# Altium project LP_LED_CUBE_8x8x8.PrjPcb
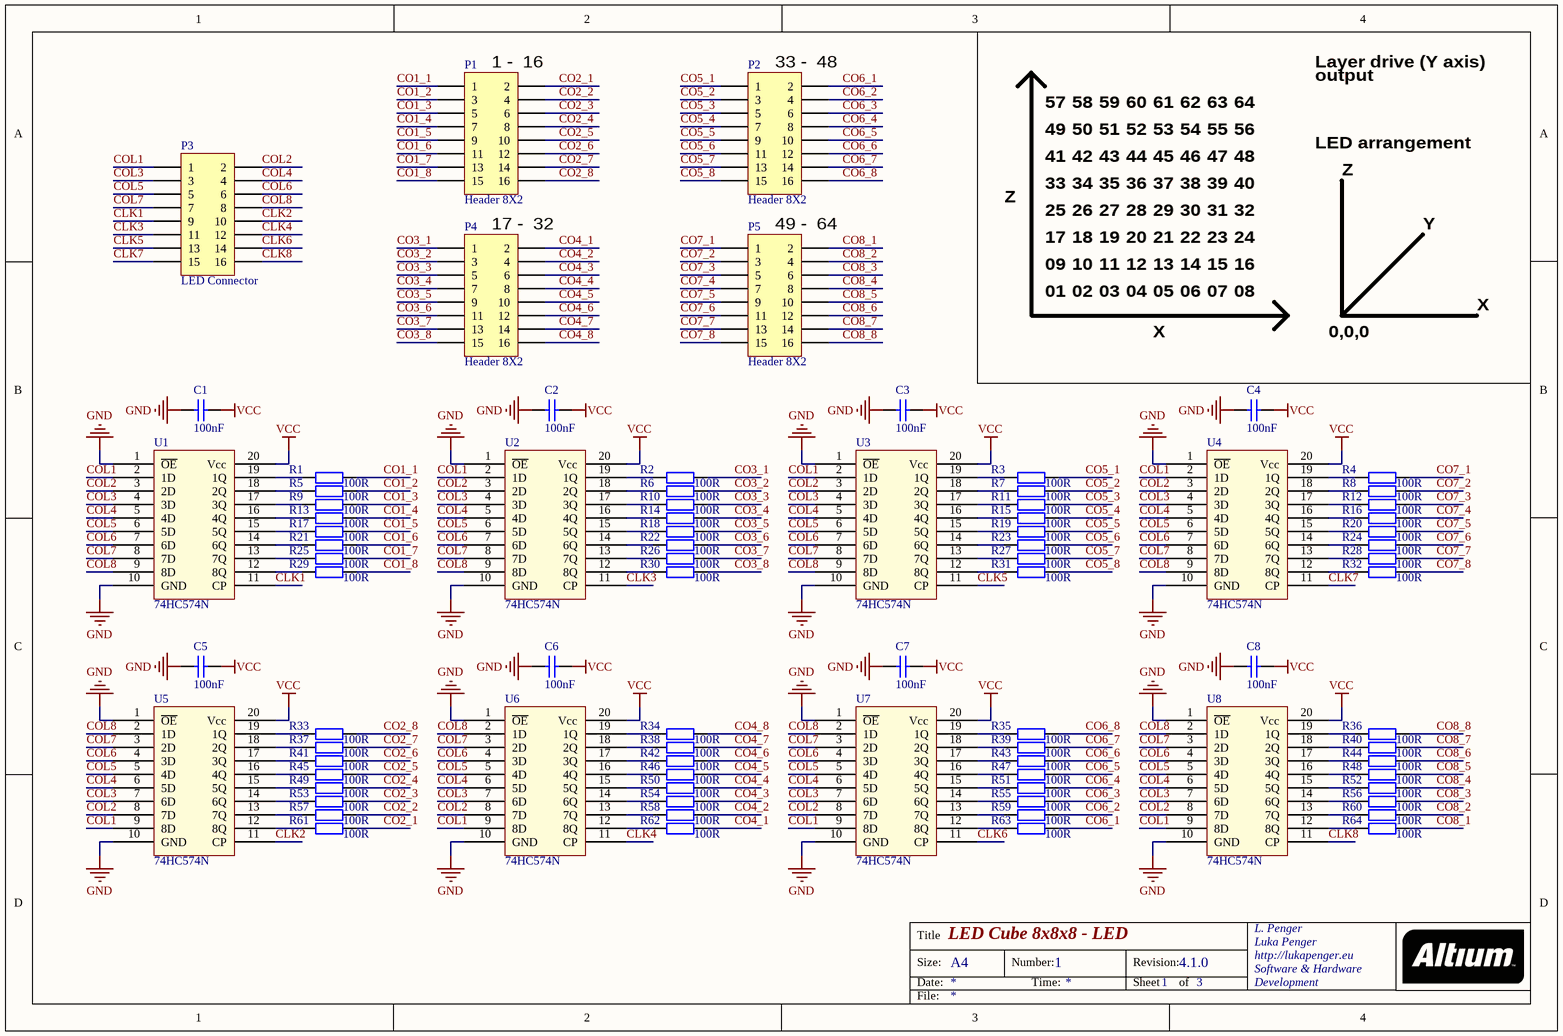
[diagram p0: LED.SchDoc]
Title: LED Cube 8x8x8
3 sheets, 153 parts. Net scope: global (net labels, ports and power ports of the same name join across sheets).
Board file: LP_LED_CUBE_8x8x8.PcbDoc
Sheets:
  LED.SchDoc
  LED_ROWS.SchDoc
  POWER.SchDoc

## Sheet LED.SchDoc: LED Cube 8x8x8 - LED
size A4; Author: Luka Penger; CompanyName: L. Penger; DrawnBy: Luka Penger; Organization: L. Penger; Address1: Luka Penger; Address2: http://lukapenger.eu; Address3: Software & Hardware; Address4: Development; DocumentNumber: 1; Revision: 4.1.0; SheetNumber: 1; SheetTotal: 3; DocumentName: LED; ProjectName: LED Cube 8x8x8

### Parts
C1  100nF  [1608[0603]]
C2  100nF  [1608[0603]]
C3  100nF  [1608[0603]]
C4  100nF  [1608[0603]]
C5  100nF  [1608[0603]]
C6  100nF  [1608[0603]]
C7  100nF  [1608[0603]]
C8  100nF  [1608[0603]]
P1  Header 8X2  [IDC-2x8]
P2  Header 8X2  [IDC-2x8]
P3  LED Connector  [IDC-2x8]
P4  Header 8X2  [IDC-2x8]
P5  Header 8X2  [IDC-2x8]
R1  100R  [C1206]
R2  100R  [C1206]
R3  100R  [C1206]
R4  100R  [C1206]
R5  100R  [C1206]
R6  100R  [C1206]
R7  100R  [C1206]
R8  100R  [C1206]
R9  100R  [C1206]
R10  100R  [C1206]
R11  100R  [C1206]
R12  100R  [C1206]
R13  100R  [C1206]
R14  100R  [C1206]
R15  100R  [C1206]
R16  100R  [C1206]
R17  100R  [C1206]
R18  100R  [C1206]
R19  100R  [C1206]
R20  100R  [C1206]
R21  100R  [C1206]
R22  100R  [C1206]
R23  100R  [C1206]
R24  100R  [C1206]
R25  100R  [C1206]
R26  100R  [C1206]
R27  100R  [C1206]
R28  100R  [C1206]
R29  100R  [C1206]
R30  100R  [C1206]
R31  100R  [C1206]
R32  100R  [C1206]
R33  100R  [C1206]
R34  100R  [C1206]
R35  100R  [C1206]
R36  100R  [C1206]
R37  100R  [C1206]
R38  100R  [C1206]
R39  100R  [C1206]
R40  100R  [C1206]
R41  100R  [C1206]
R42  100R  [C1206]
R43  100R  [C1206]
R44  100R  [C1206]
R45  100R  [C1206]
R46  100R  [C1206]
R47  100R  [C1206]
R48  100R  [C1206]
R49  100R  [C1206]
R50  100R  [C1206]
R51  100R  [C1206]
R52  100R  [C1206]
R53  100R  [C1206]
R54  100R  [C1206]
R55  100R  [C1206]
R56  100R  [C1206]
R57  100R  [C1206]
R58  100R  [C1206]
R59  100R  [C1206]
R60  100R  [C1206]
R61  100R  [C1206]
R62  100R  [C1206]
R63  100R  [C1206]
R64  100R  [C1206]
U1  74HC574N  [DIP20]
U2  74HC574N  [DIP20]
U3  74HC574N  [DIP20]
U4  74HC574N  [DIP20]
U5  74HC574N  [DIP20]
U6  74HC574N  [DIP20]
U7  74HC574N  [DIP20]
U8  74HC574N  [DIP20]

### Nets
GND: C1.1 C2.1 C3.1 C4.1 C5.1 C6.1 C7.1 C8.1 U1.1(~{OE}) U1.10(GND) U2.1(~{OE}) U2.10(GND) U3.1(~{OE}) U3.10(GND) U4.1(~{OE}) U4.10(GND) U5.1(~{OE}) U5.10(GND) U6.1(~{OE}) U6.10(GND) U7.1(~{OE}) U7.10(GND) U8.1(~{OE}) U8.10(GND)
VCC: C1.2 C2.2 C3.2 C4.2 C5.2 C6.2 C7.2 C8.2 U1.20(Vcc) U2.20(Vcc) U3.20(Vcc) U4.20(Vcc) U5.20(Vcc) U6.20(Vcc) U7.20(Vcc) U8.20(Vcc)
CLK1: P3.9 U1.11(CP)
CLK2: P3.10 U5.11(CP)
CLK3: P3.11 U2.11(CP)
CLK4: P3.12 U6.11(CP)
CLK5: P3.13 U3.11(CP)
CLK6: P3.14 U7.11(CP)
CLK7: P3.15 U4.11(CP)
CLK8: P3.16 U8.11(CP)
CO1_1: P1.1 R1.2
CO1_2: P1.3 R5.2
CO1_3: P1.5 R9.2
CO1_4: P1.7 R13.2
CO1_5: P1.9 R17.2
CO1_6: P1.11 R21.2
CO1_7: P1.13 R25.2
CO1_8: P1.15 R29.2
CO2_1: P1.2 R61.2
CO2_2: P1.4 R57.2
CO2_3: P1.6 R53.2
CO2_4: P1.8 R49.2
CO2_5: P1.10 R45.2
CO2_6: P1.12 R41.2
CO2_7: P1.14 R37.2
CO2_8: P1.16 R33.2
CO3_1: P4.1 R2.2
CO3_2: P4.3 R6.2
CO3_3: P4.5 R10.2
CO3_4: P4.7 R14.2
CO3_5: P4.9 R18.2
CO3_6: P4.11 R22.2
CO3_7: P4.13 R26.2
CO3_8: P4.15 R30.2
CO4_1: P4.2 R62.2
CO4_2: P4.4 R58.2
CO4_3: P4.6 R54.2
CO4_4: P4.8 R50.2
CO4_5: P4.10 R46.2
CO4_6: P4.12 R42.2
CO4_7: P4.14 R38.2
CO4_8: P4.16 R34.2
CO5_1: P2.1 R3.2
CO5_2: P2.3 R7.2
CO5_3: P2.5 R11.2
CO5_4: P2.7 R15.2
CO5_5: P2.9 R19.2
CO5_6: P2.11 R23.2
CO5_7: P2.13 R27.2
CO5_8: P2.15 R31.2
CO6_1: P2.2 R63.2
CO6_2: P2.4 R59.2
CO6_3: P2.6 R55.2
CO6_4: P2.8 R51.2
CO6_5: P2.10 R47.2
CO6_6: P2.12 R43.2
CO6_7: P2.14 R39.2
CO6_8: P2.16 R35.2
CO7_1: P5.1 R4.2
CO7_2: P5.3 R8.2
CO7_3: P5.5 R12.2
CO7_4: P5.7 R16.2
CO7_5: P5.9 R20.2
CO7_6: P5.11 R24.2
CO7_7: P5.13 R28.2
CO7_8: P5.15 R32.2
CO8_1: P5.2 R64.2
CO8_2: P5.4 R60.2
CO8_3: P5.6 R56.2
CO8_4: P5.8 R52.2
CO8_5: P5.10 R48.2
CO8_6: P5.12 R44.2
CO8_7: P5.14 R40.2
CO8_8: P5.16 R36.2
COL1: P3.1 U1.2(1D) U2.2(1D) U3.2(1D) U4.2(1D) U5.9(8D) U6.9(8D) U7.9(8D) U8.9(8D)
COL2: P3.2 U1.3(2D) U2.3(2D) U3.3(2D) U4.3(2D) U5.8(7D) U6.8(7D) U7.8(7D) U8.8(7D)
COL3: P3.3 U1.4(3D) U2.4(3D) U3.4(3D) U4.4(3D) U5.7(6D) U6.7(6D) U7.7(6D) U8.7(6D)
COL4: P3.4 U1.5(4D) U2.5(4D) U3.5(4D) U4.5(4D) U5.6(5D) U6.6(5D) U7.6(5D) U8.6(5D)
COL5: P3.5 U1.6(5D) U2.6(5D) U3.6(5D) U4.6(5D) U5.5(4D) U6.5(4D) U7.5(4D) U8.5(4D)
COL6: P3.6 U1.7(6D) U2.7(6D) U3.7(6D) U4.7(6D) U5.4(3D) U6.4(3D) U7.4(3D) U8.4(3D)
COL7: P3.7 U1.8(7D) U2.8(7D) U3.8(7D) U4.8(7D) U5.3(2D) U6.3(2D) U7.3(2D) U8.3(2D)
COL8: P3.8 U1.9(8D) U2.9(8D) U3.9(8D) U4.9(8D) U5.2(1D) U6.2(1D) U7.2(1D) U8.2(1D)
NetR1_1: R1.1 U1.19(1Q)
NetR2_1: R2.1 U2.19(1Q)
NetR3_1: R3.1 U3.19(1Q)
NetR4_1: R4.1 U4.19(1Q)
NetR5_1: R5.1 U1.18(2Q)
NetR6_1: R6.1 U2.18(2Q)
NetR7_1: R7.1 U3.18(2Q)
NetR8_1: R8.1 U4.18(2Q)
NetR9_1: R9.1 U1.17(3Q)
NetR10_1: R10.1 U2.17(3Q)
NetR11_1: R11.1 U3.17(3Q)
NetR12_1: R12.1 U4.17(3Q)
NetR13_1: R13.1 U1.16(4Q)
NetR14_1: R14.1 U2.16(4Q)
NetR15_1: R15.1 U3.16(4Q)
NetR16_1: R16.1 U4.16(4Q)
NetR17_1: R17.1 U1.15(5Q)
NetR18_1: R18.1 U2.15(5Q)
NetR19_1: R19.1 U3.15(5Q)
NetR20_1: R20.1 U4.15(5Q)
NetR21_1: R21.1 U1.14(6Q)
NetR22_1: R22.1 U2.14(6Q)
NetR23_1: R23.1 U3.14(6Q)
NetR24_1: R24.1 U4.14(6Q)
NetR25_1: R25.1 U1.13(7Q)
NetR26_1: R26.1 U2.13(7Q)
NetR27_1: R27.1 U3.13(7Q)
NetR28_1: R28.1 U4.13(7Q)
NetR29_1: R29.1 U1.12(8Q)
NetR30_1: R30.1 U2.12(8Q)
NetR31_1: R31.1 U3.12(8Q)
NetR32_1: R32.1 U4.12(8Q)
NetR33_1: R33.1 U5.19(1Q)
NetR34_1: R34.1 U6.19(1Q)
NetR35_1: R35.1 U7.19(1Q)
NetR36_1: R36.1 U8.19(1Q)
NetR37_1: R37.1 U5.18(2Q)
NetR38_1: R38.1 U6.18(2Q)
NetR39_1: R39.1 U7.18(2Q)
NetR40_1: R40.1 U8.18(2Q)
NetR41_1: R41.1 U5.17(3Q)
NetR42_1: R42.1 U6.17(3Q)
NetR43_1: R43.1 U7.17(3Q)
NetR44_1: R44.1 U8.17(3Q)
NetR45_1: R45.1 U5.16(4Q)
NetR46_1: R46.1 U6.16(4Q)
NetR47_1: R47.1 U7.16(4Q)
NetR48_1: R48.1 U8.16(4Q)
NetR49_1: R49.1 U5.15(5Q)
NetR50_1: R50.1 U6.15(5Q)
NetR51_1: R51.1 U7.15(5Q)
NetR52_1: R52.1 U8.15(5Q)
NetR53_1: R53.1 U5.14(6Q)
NetR54_1: R54.1 U6.14(6Q)
NetR55_1: R55.1 U7.14(6Q)
NetR56_1: R56.1 U8.14(6Q)
NetR57_1: R57.1 U5.13(7Q)
NetR58_1: R58.1 U6.13(7Q)
NetR59_1: R59.1 U7.13(7Q)
NetR60_1: R60.1 U8.13(7Q)
NetR61_1: R61.1 U5.12(8Q)
NetR62_1: R62.1 U6.12(8Q)
NetR63_1: R63.1 U7.12(8Q)
NetR64_1: R64.1 U8.12(8Q)

### Notes on the sheet
- (near P1) 1 -  16
- (near P2) 33 -  48
- 57
- 58
- 59
- 60
- 61
- 62
- 63
- 64
- Layer drive (Y axis)
- output
- 41
- 49
- 42
- 50
- 43
- 51
- 44
- 52
- 45
- 53
- 46
- 54
- 47
- 55
- 48
- 56
- LED arrangement
- Z
- (near P4) 17 -  32
- (near P5) 49 -  64
- 17
- 25
- 33
- 18
- 26
- 34
- 19
- 27
- 35
- 20
- 28
- 36
- 21
- 29
- 37
- 22
- 30
- 38
- 23
- 31
- 39
- 24
- 32
- 40
- Y
- 01
- 09
- 02
- 10
- 03
- 11
- 04
- 12
- 05
- 13
- 06
- 14
- 07
- 15
- 08
- 16
- X
- 0,0,0
- Title
- Size:
- Date:
- A4
- Number:
- Time:
- Revision:
- Sheet
- of
- File:

### Library data of the parts
C1-C8 = Cap: Capacitor; Value: 100pF; Published: 8-Jun-2000; LatestRevisionDate: 17-Jul-2002; LatestRevisionNote: Re-released for DXP Platform.; PackageReference: RAD-0.3; Publisher: Altium Limited; PackageDescription: Radial Cap, Thru-Hole; 2 Leads; 0.3 in Pin Spacing
P1-P5 = Header 8X2: Header, 8-Pin, Dual row; LatestRevisionDate: 17-Jul-2002; LatestRevisionNote: Re-released for DXP Platform.; Publisher: Altium Limited
R1-R64 = Res2: Resistor; Value: 1K; Published: 8-Jun-2000; LatestRevisionDate: 17-Jul-2002; LatestRevisionNote: Re-released for DXP Platform.; PackageReference: AXIAL-0.4; Publisher: Altium Limited; PackageDescription: Axial Device, Thru-Hole; 2 Leads; 0.4 in Pin Spacing
U1-U8 = 74HCT574: D Flip Flops

## Sheet LED_ROWS.SchDoc: LED Cube 8x8x8 - LED
size A4; Author: Luka Penger; CompanyName: L. Penger; DrawnBy: Luka Penger; Organization: L. Penger; Address1: Luka Penger; Address2: http://lukapenger.eu; Address3: Software & Hardware; Address4: Development; DocumentNumber: 2; Revision: 4.1.0; SheetNumber: 2; SheetTotal: 3; DocumentName: LED ROWS; ProjectName: LED Cube 8x8x8
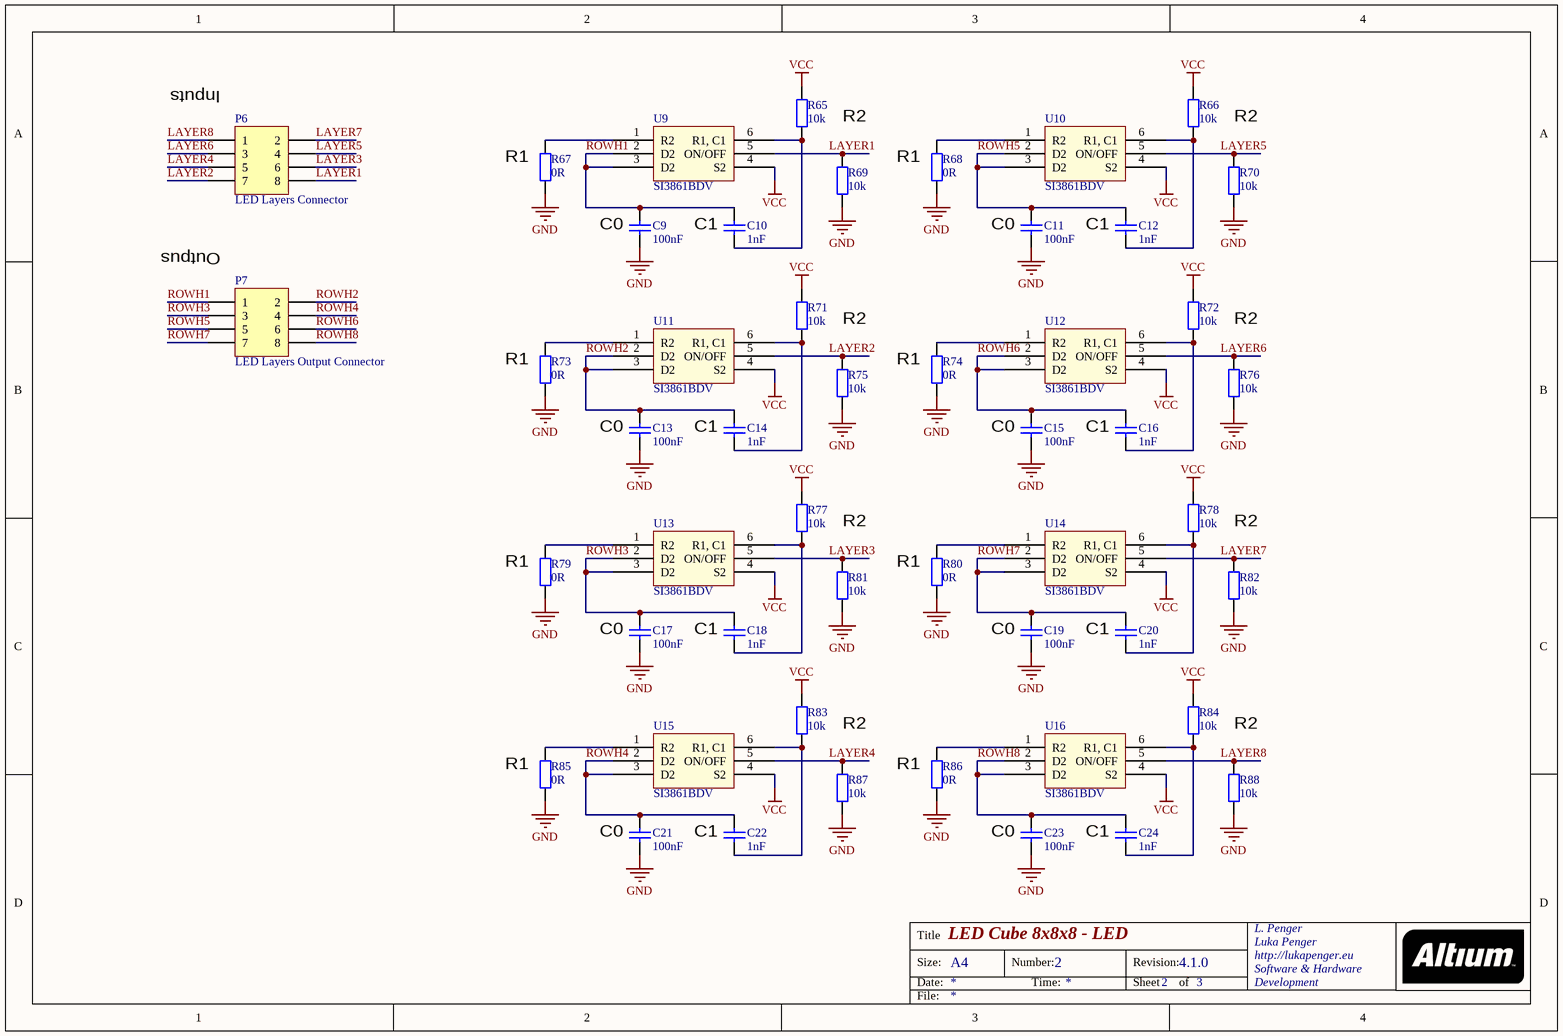
[diagram p1: LED_ROWS.SchDoc]

### Parts
C9  100nF  [1608[0603]]
C10  1nF  [1608[0603]]
C11  100nF  [1608[0603]]
C12  1nF  [1608[0603]]
C13  100nF  [1608[0603]]
C14  1nF  [1608[0603]]
C15  100nF  [1608[0603]]
C16  1nF  [1608[0603]]
C17  100nF  [1608[0603]]
C18  1nF  [1608[0603]]
C19  100nF  [1608[0603]]
C20  1nF  [1608[0603]]
C21  100nF  [1608[0603]]
C22  1nF  [1608[0603]]
C23  100nF  [1608[0603]]
C24  1nF  [1608[0603]]
P6  LED Layers Connector  [IDC-2x4]
P7  LED Layers Output Connector  [IDC-2x4]
R65  10k  [1608[0603]]
R66  10k  [1608[0603]]
R67  0R  [1608[0603]]
R68  0R  [1608[0603]]
R69  10k  [1608[0603]]
R70  10k  [1608[0603]]
R71  10k  [1608[0603]]
R72  10k  [1608[0603]]
R73  0R  [1608[0603]]
R74  0R  [1608[0603]]
R75  10k  [1608[0603]]
R76  10k  [1608[0603]]
R77  10k  [1608[0603]]
R78  10k  [1608[0603]]
R79  0R  [1608[0603]]
R80  0R  [1608[0603]]
R81  10k  [1608[0603]]
R82  10k  [1608[0603]]
R83  10k  [1608[0603]]
R84  10k  [1608[0603]]
R85  0R  [1608[0603]]
R86  0R  [1608[0603]]
R87  10k  [1608[0603]]
R88  10k  [1608[0603]]
U9  SI3861BDV  [TSOP 6]
U10  SI3861BDV  [TSOP 6]
U11  SI3861BDV  [TSOP 6]
U12  SI3861BDV  [TSOP 6]
U13  SI3861BDV  [TSOP 6]
U14  SI3861BDV  [TSOP 6]
U15  SI3861BDV  [TSOP 6]
U16  SI3861BDV  [TSOP 6]

### Nets
GND: C9.2 C11.2 C13.2 C15.2 C17.2 C19.2 C21.2 C23.2 R67.2 R68.2 R69.1 R70.1 R73.2 R74.2 R75.1 R76.1 R79.2 R80.2 R81.1 R82.1 R85.2 R86.2 R87.1 R88.1
VCC: R65.2 R66.2 R71.2 R72.2 R77.2 R78.2 R83.2 R84.2 U9.4(S2) U10.4(S2) U11.4(S2) U12.4(S2) U13.4(S2) U14.4(S2) U15.4(S2) U16.4(S2)
LAYER1: P6.8 R69.2 U9.5(ON/OFF)
LAYER2: P6.7 R75.2 U11.5(ON/OFF)
LAYER3: P6.6 R81.2 U13.5(ON/OFF)
LAYER4: P6.5 R87.2 U15.5(ON/OFF)
LAYER5: P6.4 R70.2 U10.5(ON/OFF)
LAYER6: P6.3 R76.2 U12.5(ON/OFF)
LAYER7: P6.2 R82.2 U14.5(ON/OFF)
LAYER8: P6.1 R88.2 U16.5(ON/OFF)
ROWH1: C9.1 C10.1 P7.1 U9.2(D2) U9.3(D2)
ROWH2: C13.1 C14.1 P7.2 U11.2(D2) U11.3(D2)
ROWH3: C17.1 C18.1 P7.3 U13.2(D2) U13.3(D2)
ROWH4: C21.1 C22.1 P7.4 U15.2(D2) U15.3(D2)
ROWH5: C11.1 C12.1 P7.5 U10.2(D2) U10.3(D2)
ROWH6: C15.1 C16.1 P7.6 U12.2(D2) U12.3(D2)
ROWH7: C19.1 C20.1 P7.7 U14.2(D2) U14.3(D2)
ROWH8: C23.1 C24.1 P7.8 U16.2(D2) U16.3(D2)
NetC10_2: C10.2 R65.1 U9.6(R1,_C1)
NetC12_2: C12.2 R66.1 U10.6(R1,_C1)
NetC14_2: C14.2 R71.1 U11.6(R1,_C1)
NetC16_2: C16.2 R72.1 U12.6(R1,_C1)
NetC18_2: C18.2 R77.1 U13.6(R1,_C1)
NetC20_2: C20.2 R78.1 U14.6(R1,_C1)
NetC22_2: C22.2 R83.1 U15.6(R1,_C1)
NetC24_2: C24.2 R84.1 U16.6(R1,_C1)
NetR67_1: R67.1 U9.1(R2)
NetR68_1: R68.1 U10.1(R2)
NetR73_1: R73.1 U11.1(R2)
NetR74_1: R74.1 U12.1(R2)
NetR79_1: R79.1 U13.1(R2)
NetR80_1: R80.1 U14.1(R2)
NetR85_1: R85.1 U15.1(R2)
NetR86_1: R86.1 U16.1(R2)

### Notes on the sheet
- (near P6) Inputs
- (near R67) R1
- R2
- (near R68) R1
- (near P7) Outpus
- (near C9) C0
- (near C10) C1
- (near C11) C0
- (near C12) C1
- (near R73) R1
- (near R74) R1
- (near C13) C0
- (near C14) C1
- (near C15) C0
- (near C16) C1
- (near R79) R1
- (near R80) R1
- (near C17) C0
- (near C18) C1
- (near C19) C0
- (near C20) C1
- (near R85) R1
- (near R86) R1
- (near C21) C0
- (near C22) C1
- (near C23) C0
- (near C24) C1
- Title
- Size:
- Date:
- A4
- Number:
- Time:
- Revision:
- Sheet
- of
- File:

### Library data of the parts
C9-C24 = Cap: Capacitor; Value: 100pF; Published: 8-Jun-2000; LatestRevisionDate: 17-Jul-2002; LatestRevisionNote: Re-released for DXP Platform.; PackageReference: RAD-0.3; Publisher: Altium Limited; PackageDescription: Radial Cap, Thru-Hole; 2 Leads; 0.3 in Pin Spacing
P6 P7 = Header 4X2: Header, 4-Pin, Dual row; LatestRevisionDate: 17-Jul-2002; LatestRevisionNote: Re-released for DXP Platform.; Publisher: Altium Limited
R65-R88 = Res2: Resistor; Value: 1K; Published: 8-Jun-2000; LatestRevisionDate: 17-Jul-2002; LatestRevisionNote: Re-released for DXP Platform.; PackageReference: AXIAL-0.4; Publisher: Altium Limited; PackageDescription: Axial Device, Thru-Hole; 2 Leads; 0.4 in Pin Spacing
U9-U16 = SI3861BDV: 4.5 - 20V 2.3A Load Switch

## Sheet POWER.SchDoc: LED Cube 8x8x8 - POWER
size A4; Author: Luka Penger; CompanyName: L. Penger; DrawnBy: Luka Penger; Organization: L. Penger; Address1: Luka Penger; Address2: http://lukapenger.eu; Address3: Software & Hardware; Address4: Development; DocumentNumber: 3; Revision: 4.1.0; SheetNumber: 3; SheetTotal: 3; DocumentName: POWER; ProjectName: LED Cube 8x8x8
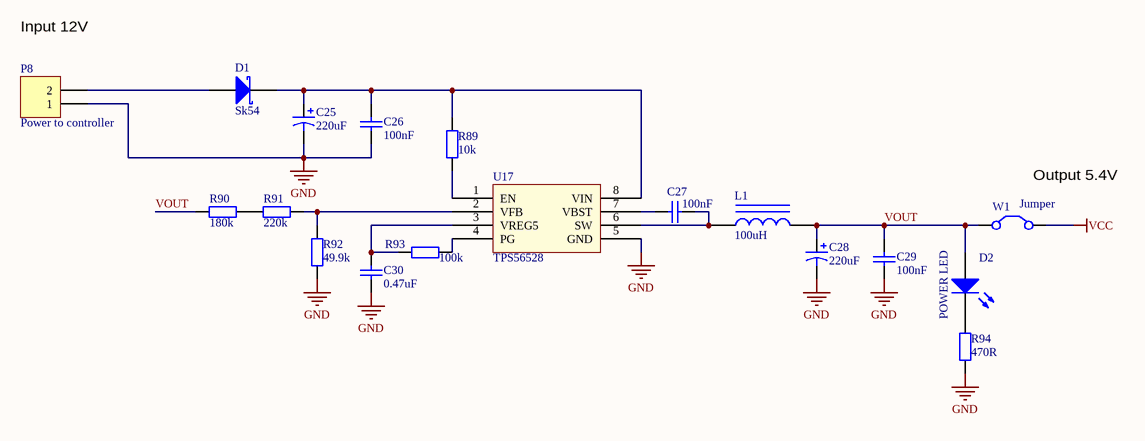
[diagram p2: POWER.SchDoc]

### Parts
C25  220uF  [SMD CAPACITOR 220uF]
C26  100nF  [1608[0603]]
C27  100nF  [1608[0603]]
C28  220uF  [SMD CAPACITOR 220uF]
C29  100nF  [1608[0603]]
C30  0.47uF  [1608[0603]]
D1  Sk54  [DIODE SMC 6x7mm]
D2  POWER LED  [LED-1]
L1  100uH  [SMD Inductor 12x12mm]
P8  Power to controller  [Block2 - 3.81]
R89  10k  [1608[0603]]
R90  180k  [6-0805_L]
R91  220k  [6-0805_L]
R92  49.9k  [1608[0603]]
R93  100k  [1608[0603]]
R94  470R  [1608[0603]]
U17  TPS56528  [TPS56528]
W1  Jumper  [HDR1X2]

### Nets
GND: C25.2 C26.2 C28.2 C29.2 C30.2 P8.1 R92.1 R94.1 U17.5(GND)
VCC: W1.2(C2)
VOUT: C28.1 C29.1 D2.1(A) L1.2 R90.2 W1.1(C1)
NetC25_1: C25.1 C26.1 D1.2(K) R89.2 U17.8(VIN)
NetC27_1: C27.1 U17.7(VBST)
NetC27_2: C27.2 L1.1 U17.6(SW)
NetC30_1: C30.1 R93.2 U17.3(VREG5)
NetD1_1: D1.1(A) P8.2
NetD2_2: D2.2(K) R94.2
NetR89_1: R89.1 U17.1(EN)
NetR90_1: R90.1 R91.2
NetR91_1: R91.1 R92.2 U17.2(VFB)
NetR93_1: R93.1 U17.4(PG)

### Notes on the sheet
- Input 12V
- (near W1) Output 5.4V
- Title
- Size:
- Date:
- A4
- Number:
- Time:
- Revision:
- Sheet
- of
- File:

### Library data of the parts
C25 C28 = Cap Pol1: Capacitor; Value: 100pF; Published: 8-Jun-2000; LatestRevisionDate: 17-Jul-2002; LatestRevisionNote: Re-released for DXP Platform.; PackageReference: RB7.6-15; Publisher: Altium Limited; PackageDescription: Polarized Capacitor (Radial); 2 Leads
C26 C27 C29 C30 = Cap: Capacitor; Value: 100pF; Published: 8-Jun-2000; LatestRevisionDate: 17-Jul-2002; LatestRevisionNote: Re-released for DXP Platform.; PackageReference: RAD-0.3; Publisher: Altium Limited; PackageDescription: Radial Cap, Thru-Hole; 2 Leads; 0.3 in Pin Spacing
D1 = D Schottky: Schottky Diode; Published: 8-Jun-2000; LatestRevisionDate: 17-Jul-2002; LatestRevisionNote: Re-released for DXP Platform.; PackageReference: SMB; Publisher: Altium Limited; PackageDescription: DO-214-AA/SMB; 2 C-Bend Leads; Body 5.3 x 3.6 mm, inc. leads (LxW); Code_JEDEC: DO-214-AA
D2 = LED0: Typical INFRARED GaAs LED; Published: 8-Jun-2000; LatestRevisionDate: 08-Jul-2005; LatestRevisionNote: Mech Layer 1 removed.; PackageReference: LED-0; Publisher: Altium Limited; PackageDescription: LED; 2 Leads
L1 = Inductor Iron: Magnetic-Core Inductor; Value: 10mH; Published: 24-Mar-1999; LatestRevisionDate: 17-Jul-2002; LatestRevisionNote: Re-released for DXP Platform.; PackageReference: AXIAL-0.9; Publisher: Altium Limited; PackageDescription: Axial Device, Thru-Hole; 2 Leads; 0.9 in Pin Spacing
P8 = Header 2: Header, 2-Pin; LatestRevisionDate: 17-Jul-2002; LatestRevisionNote: Re-released for DXP Platform.; Publisher: Altium Limited
R89-R94 = Res2: Resistor; Value: 1K; Published: 8-Jun-2000; LatestRevisionDate: 17-Jul-2002; LatestRevisionNote: Re-released for DXP Platform.; PackageReference: AXIAL-0.4; Publisher: Altium Limited; PackageDescription: Axial Device, Thru-Hole; 2 Leads; 0.4 in Pin Spacing
U17 = TPS56528: Step-Down Converter 5A 4.5V-18V
W1 = Jumper: Jumper Wire; Published: 24-Mar-1999; LatestRevisionDate: 17-Jul-2002; LatestRevisionNote: Re-released for DXP Platform.; PackageReference: RAD-0.2; Publisher: Altium Limited; PackageDescription: Radial Cap, Thru-Hole; 2 Leads; 0.2 in Pin Spacing

## Nets that join several sheets
GND: LED (24 pins), LED_ROWS (24 pins), POWER (9 pins)
VCC: LED (16 pins), LED_ROWS (16 pins), POWER (W1.2)